# Altium schematic sheet Bank_3.SchDoc: Kasli-DIOT
size 420 x 297 mm; EDA_Number: ARTIQ; Projet: ARTIQ/SINARA; Author: G.Kasprowicz; CompanyName: WUT ISE; DrawnBy: F.Świtakowski; Organization: WUT ISE; Address1: PW ISE; Address2: Nowowiejska 15/19 00-665 Warsaw; Address3: gkasprow@gmail.com; Revision: 1; SheetNumber: -; SheetTotal: -; ModifiedBy: -; CheckedDate: -; Title2: Bank 16 32 36; DivGrp: WUT ISE; Designer: F.Świtakowski; ModifiedDate: -; ProjectName: Sensor Box
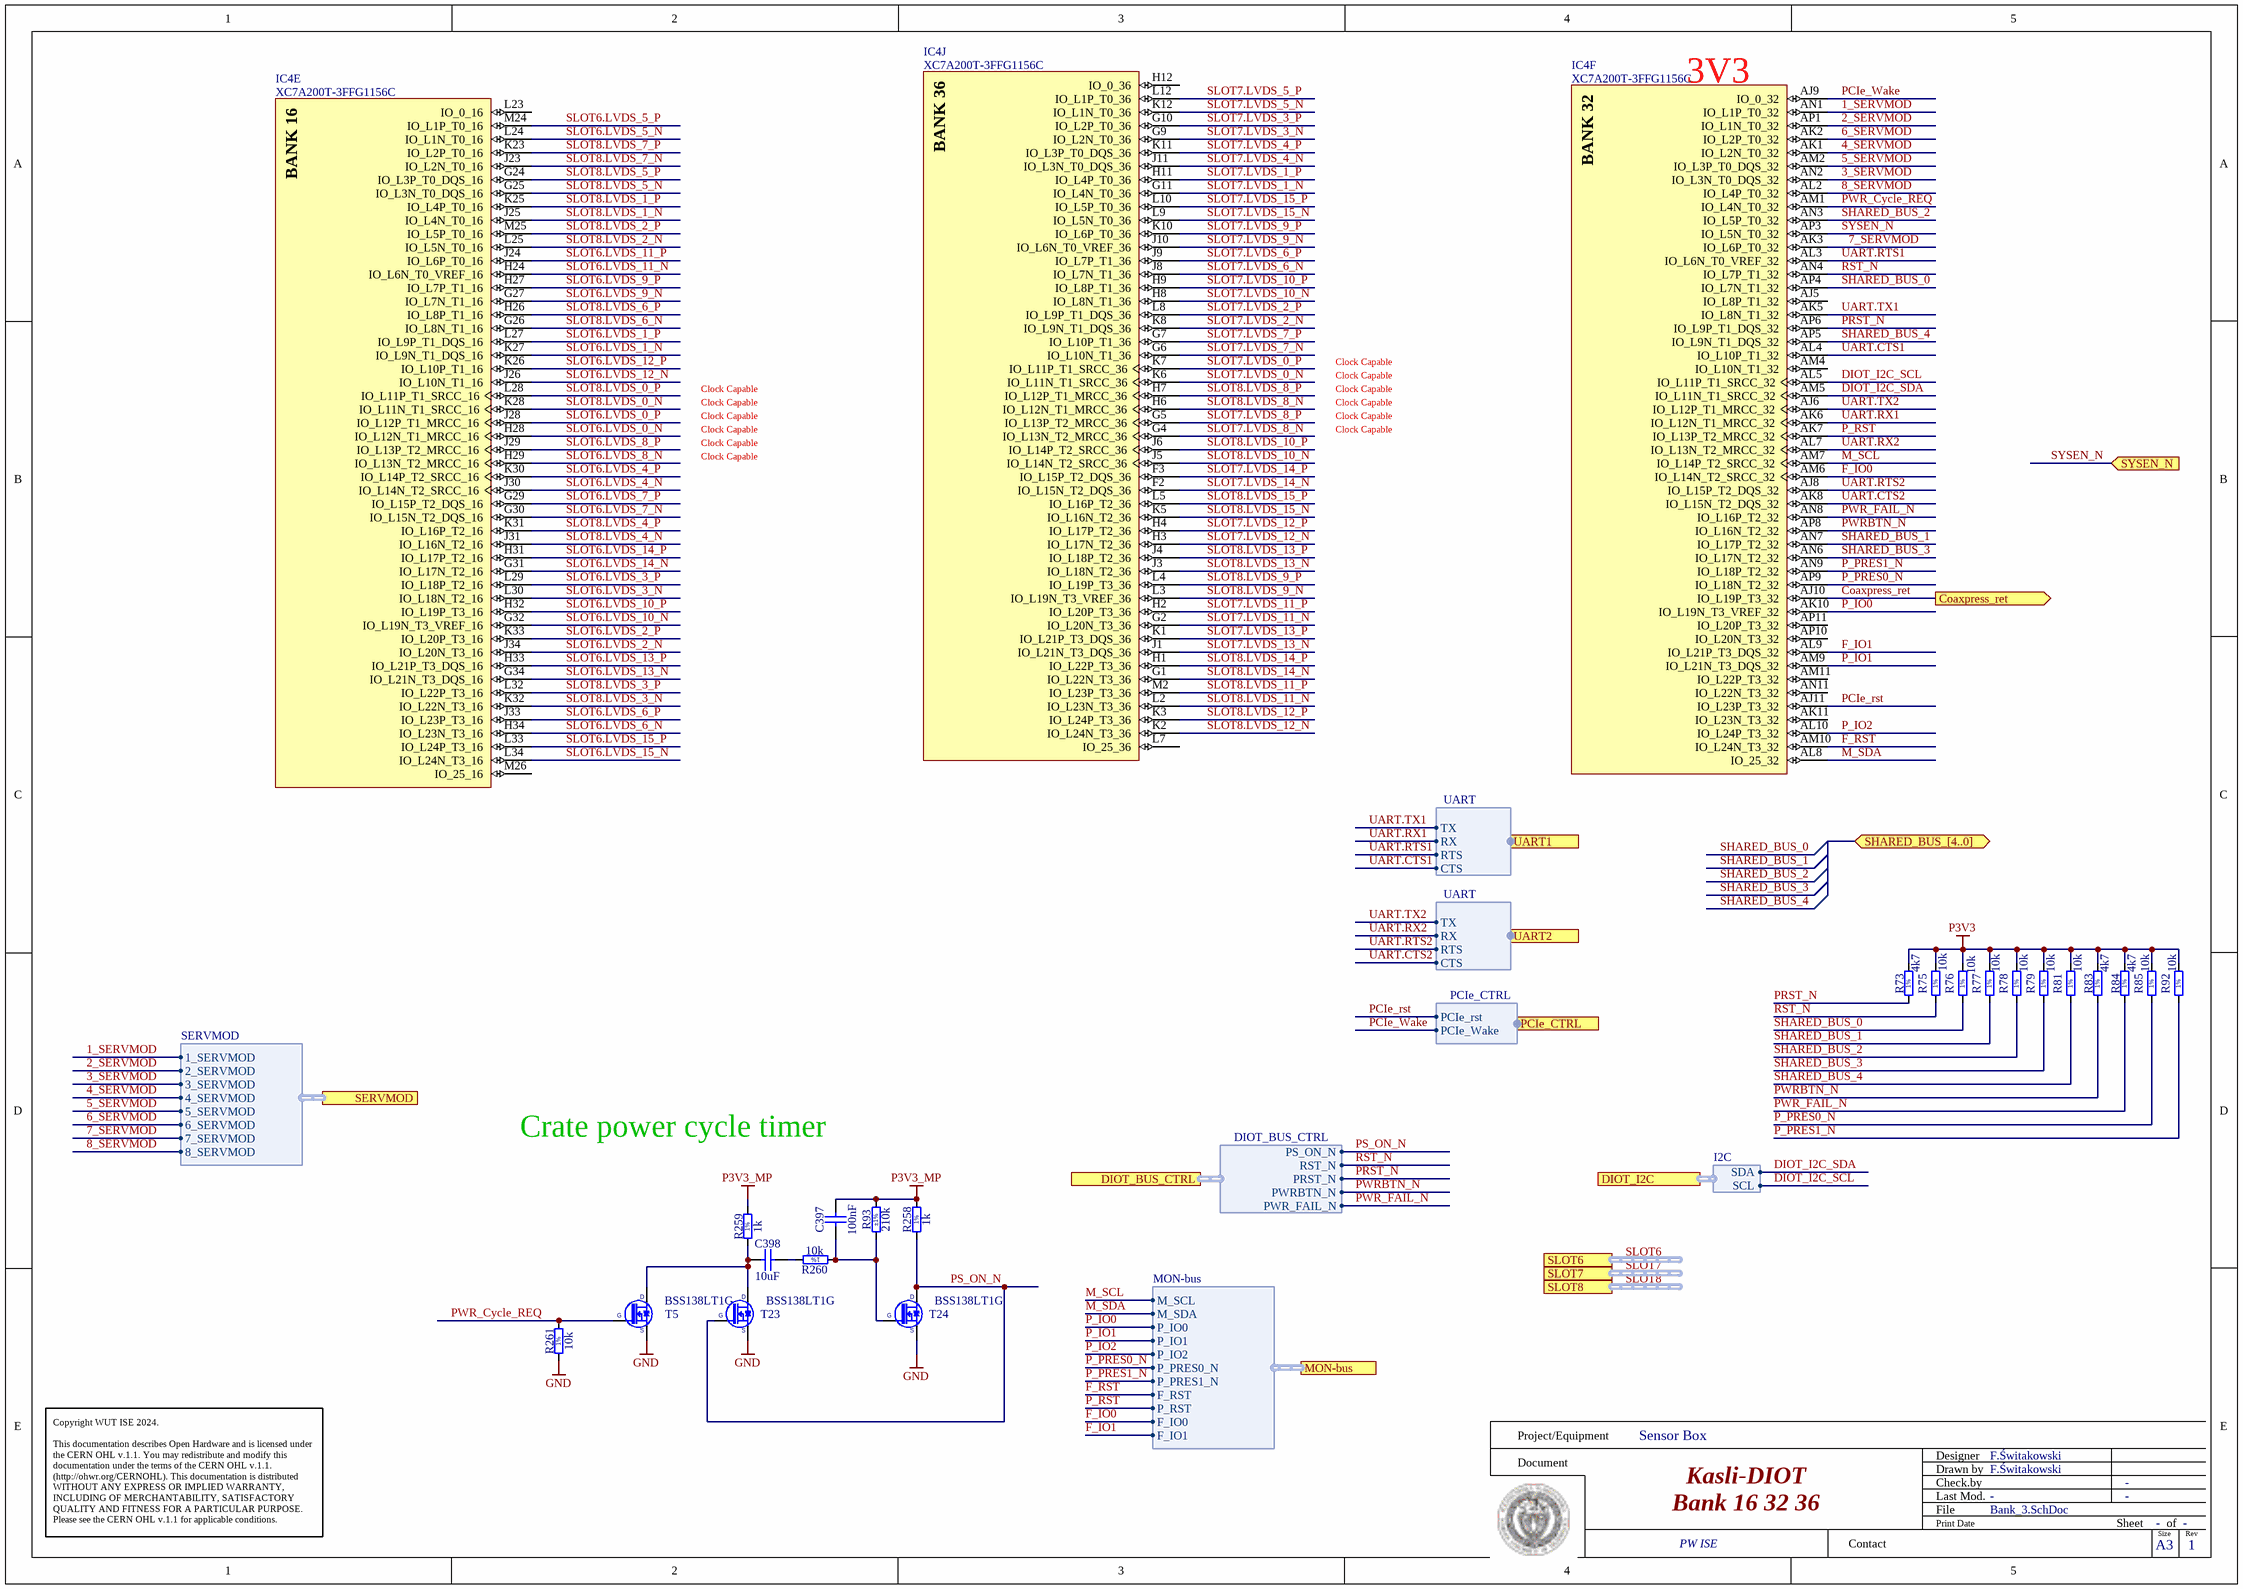
[diagram p0: Bank_3.SchDoc]

## Parts
C397  100nF  [CAPC1005X55N]
C398  10uF  [CAPC3216X180N]
IC4  XC7A200T-3FFG1156C  [BGA1156C100P34X34_3500X3500X310]  (parts E,F,J of 18)
R73  4k7  [RESC1005X40N]
R75  10k  [RESC1005X40N]
R76  10k  [RESC1005X40N]
R77  10k  [RESC1005X40N]
R78  10k  [RESC1005X40N]
R79  10k  [RESC1005X40N]
R81  10k  [RESC1005X40N]
R83  4k7  [RESC1005X40N]
R84  4k7  [RESC1005X40N]
R85  10k  [RESC1005X40N]
R92  10k  [RESC1005X40N]
R93  210k  Tolerance: ±1%  [RESC1005X40N]
R258  1k  [RESC1005X40N]
R259  1k  [RESC1005X40N]
R260  10k  [RESC1005X40N]
R261  10k  [RESC1005X40N]
T5  BSS138LT1G  [SOT95P240X110-3N]
T23  BSS138LT1G  [SOT95P240X110-3N]
T24  BSS138LT1G  [SOT95P240X110-3N]

## Ports
Coaxpress_ret (out), DIOT_BUS_CTRL (harness DIOT_BUS_CTRL), DIOT_I2C (harness I2C), MON-bus (harness MON-bus), PCIe_CTRL (harness PCIe_CTRL), SERVMOD (harness SERVMOD), SHARED_BUS_[4..0] (bidir), SLOT6 (harness SLOT), SLOT7 (harness SLOT), SLOT8 (harness SLOT), SYSEN_N (in), UART1 (harness UART), UART2 (harness UART)

## Harnesses
DIOT_BUS_CTRL: PS_ON_N, RST_N, PRST_N, PWRBTN_N, PWR_FAIL_N
I2C: SDA, SCL
SERVMOD: 5_SERVMOD, 6_SERVMOD, 2_SERVMOD, 7_SERVMOD, 3_SERVMOD, 4_SERVMOD, 1_SERVMOD, 8_SERVMOD
MON-bus: M_SCL, M_SDA, P_IO0, P_IO1, P_IO2, P_PRES0_N, P_PRES1_N, F_RST, P_RST, F_IO0, F_IO1
UART: TX, RX, RTS, CTS
PCIe_CTRL: PCIe_rst, PCIe_Wake

## Nets
GND: R261.1 T5.2(S) T23.2(S) T24.2(S)
P3V3: R73.2 R75.2 R76.2 R77.2 R78.2 R79.2 R81.2 R83.2 R84.2 R85.2 R92.2
P3V3_MP: C397.2 R93.2 R258.2 R259.2
1_SERVMOD: IC4.AN1(IO_L1P_T0_32) ; port SERVMOD.1_SERVMOD
2_SERVMOD: IC4.AP1(IO_L1N_T0_32) ; port SERVMOD.2_SERVMOD
3_SERVMOD: IC4.AN2(IO_L3N_T0_DQS_32) ; port SERVMOD.3_SERVMOD
4_SERVMOD: IC4.AK1(IO_L2N_T0_32) ; port SERVMOD.4_SERVMOD
5_SERVMOD: IC4.AM2(IO_L3P_T0_DQS_32) ; port SERVMOD.5_SERVMOD
6_SERVMOD: IC4.AK2(IO_L2P_T0_32) ; port SERVMOD.6_SERVMOD
7_SERVMOD: IC4.AK3(IO_L6P_T0_32) ; port SERVMOD.7_SERVMOD
8_SERVMOD: IC4.AL2(IO_L4P_T0_32) ; port SERVMOD.8_SERVMOD
Coaxpress_ret: IC4.AJ10(IO_L19P_T3_32) ; port Coaxpress_ret
DIOT_I2C_SCL: IC4.AL5(IO_L11P_T1_SRCC_32) ; port DIOT_I2C.SCL
DIOT_I2C_SDA: IC4.AM5(IO_L11N_T1_SRCC_32) ; port DIOT_I2C.SDA
F_IO0: IC4.AM6(IO_L14N_T2_SRCC_32) ; port MON-bus.F_IO0
F_IO1: IC4.AL9(IO_L21P_T3_DQS_32) ; port MON-bus.F_IO1
F_RST: IC4.AM10(IO_L24N_T3_32) ; port MON-bus.F_RST
M_SCL: IC4.AM7(IO_L14P_T2_SRCC_32) ; port MON-bus.M_SCL
M_SDA: IC4.AL8(IO_25_32) ; port MON-bus.M_SDA
P_IO0: IC4.AK10(IO_L19N_T3_VREF_32) ; port MON-bus.P_IO0
P_IO1: IC4.AM9(IO_L21N_T3_DQS_32) ; port MON-bus.P_IO1
P_IO2: IC4.AL10(IO_L24P_T3_32) ; port MON-bus.P_IO2
P_PRES0_N: IC4.AP9(IO_L18N_T2_32) R85.1 ; port MON-bus.P_PRES0_N
P_PRES1_N: IC4.AN9(IO_L18P_T2_32) R92.1 ; port MON-bus.P_PRES1_N
P_RST: IC4.AK7(IO_L13P_T2_MRCC_32) ; port MON-bus.P_RST
PCIe_rst: IC4.AJ11(IO_L23P_T3_32) ; port PCIe_CTRL.PCIe_rst
PCIe_Wake: IC4.AJ9(IO_0_32) ; port PCIe_CTRL.PCIe_Wake
PRST_N: IC4.AP6(IO_L9P_T1_DQS_32) R73.1 ; port DIOT_BUS_CTRL.PRST_N
PS_ON_N: R258.1 T23.1(G) T24.3(D) ; port DIOT_BUS_CTRL.PS_ON_N
PWR_Cycle_REQ: IC4.AM1(IO_L4N_T0_32) R261.2 T5.1(G)
PWR_FAIL_N: IC4.AN8(IO_L16P_T2_32) R84.1 ; port DIOT_BUS_CTRL.PWR_FAIL_N
PWRBTN_N: IC4.AP8(IO_L16N_T2_32) R83.1 ; port DIOT_BUS_CTRL.PWRBTN_N
RST_N: IC4.AN4(IO_L7P_T1_32) R75.1 ; port DIOT_BUS_CTRL.RST_N
SHARED_BUS_0: IC4.AP4(IO_L7N_T1_32) R76.1
SHARED_BUS_1: IC4.AN7(IO_L17P_T2_32) R77.1
SHARED_BUS_2: IC4.AN3(IO_L5P_T0_32) R78.1
SHARED_BUS_3: IC4.AN6(IO_L17N_T2_32) R79.1
SHARED_BUS_4: IC4.AP5(IO_L9N_T1_DQS_32) R81.1
SLOT6.LVDS_0_N: IC4.H28(IO_L12N_T1_MRCC_16)
SLOT6.LVDS_0_P: IC4.J28(IO_L12P_T1_MRCC_16)
SLOT6.LVDS_1_N: IC4.K27(IO_L9N_T1_DQS_16)
SLOT6.LVDS_1_P: IC4.L27(IO_L9P_T1_DQS_16)
SLOT6.LVDS_2_N: IC4.J34(IO_L20N_T3_16)
SLOT6.LVDS_2_P: IC4.K33(IO_L20P_T3_16)
SLOT6.LVDS_3_N: IC4.L30(IO_L18N_T2_16)
SLOT6.LVDS_3_P: IC4.L29(IO_L18P_T2_16)
SLOT6.LVDS_4_N: IC4.J30(IO_L14N_T2_SRCC_16)
SLOT6.LVDS_4_P: IC4.K30(IO_L14P_T2_SRCC_16)
SLOT6.LVDS_5_N: IC4.L24(IO_L1N_T0_16)
SLOT6.LVDS_5_P: IC4.M24(IO_L1P_T0_16)
SLOT6.LVDS_6_N: IC4.H34(IO_L23N_T3_16)
SLOT6.LVDS_6_P: IC4.J33(IO_L23P_T3_16)
SLOT6.LVDS_7_N: IC4.G30(IO_L15N_T2_DQS_16)
SLOT6.LVDS_7_P: IC4.G29(IO_L15P_T2_DQS_16)
SLOT6.LVDS_8_N: IC4.H29(IO_L13N_T2_MRCC_16)
SLOT6.LVDS_8_P: IC4.J29(IO_L13P_T2_MRCC_16)
SLOT6.LVDS_9_N: IC4.G27(IO_L7N_T1_16)
SLOT6.LVDS_9_P: IC4.H27(IO_L7P_T1_16)
SLOT6.LVDS_10_N: IC4.G32(IO_L19N_T3_VREF_16)
SLOT6.LVDS_10_P: IC4.H32(IO_L19P_T3_16)
SLOT6.LVDS_11_N: IC4.H24(IO_L6N_T0_VREF_16)
SLOT6.LVDS_11_P: IC4.J24(IO_L6P_T0_16)
SLOT6.LVDS_12_N: IC4.J26(IO_L10N_T1_16)
SLOT6.LVDS_12_P: IC4.K26(IO_L10P_T1_16)
SLOT6.LVDS_13_N: IC4.G34(IO_L21N_T3_DQS_16)
SLOT6.LVDS_13_P: IC4.H33(IO_L21P_T3_DQS_16)
SLOT6.LVDS_14_N: IC4.G31(IO_L17N_T2_16)
SLOT6.LVDS_14_P: IC4.H31(IO_L17P_T2_16)
SLOT6.LVDS_15_N: IC4.L34(IO_L24N_T3_16)
SLOT6.LVDS_15_P: IC4.L33(IO_L24P_T3_16)
SLOT7.LVDS_0_N: IC4.K6(IO_L11N_T1_SRCC_36)
SLOT7.LVDS_0_P: IC4.K7(IO_L11P_T1_SRCC_36)
SLOT7.LVDS_1_N: IC4.G11(IO_L4N_T0_36)
SLOT7.LVDS_1_P: IC4.H11(IO_L4P_T0_36)
SLOT7.LVDS_2_N: IC4.K8(IO_L9N_T1_DQS_36)
SLOT7.LVDS_2_P: IC4.L8(IO_L9P_T1_DQS_36)
SLOT7.LVDS_3_N: IC4.G9(IO_L2N_T0_36)
SLOT7.LVDS_3_P: IC4.G10(IO_L2P_T0_36)
SLOT7.LVDS_4_N: IC4.J11(IO_L3N_T0_DQS_36)
SLOT7.LVDS_4_P: IC4.K11(IO_L3P_T0_DQS_36)
SLOT7.LVDS_5_N: IC4.K12(IO_L1N_T0_36)
SLOT7.LVDS_5_P: IC4.L12(IO_L1P_T0_36)
SLOT7.LVDS_6_N: IC4.J8(IO_L7N_T1_36)
SLOT7.LVDS_6_P: IC4.J9(IO_L7P_T1_36)
SLOT7.LVDS_7_N: IC4.G6(IO_L10N_T1_36)
SLOT7.LVDS_7_P: IC4.G7(IO_L10P_T1_36)
SLOT7.LVDS_8_N: IC4.G4(IO_L13N_T2_MRCC_36)
SLOT7.LVDS_8_P: IC4.G5(IO_L13P_T2_MRCC_36)
SLOT7.LVDS_9_N: IC4.J10(IO_L6N_T0_VREF_36)
SLOT7.LVDS_9_P: IC4.K10(IO_L6P_T0_36)
SLOT7.LVDS_10_N: IC4.H8(IO_L8N_T1_36)
SLOT7.LVDS_10_P: IC4.H9(IO_L8P_T1_36)
SLOT7.LVDS_11_N: IC4.G2(IO_L20N_T3_36)
SLOT7.LVDS_11_P: IC4.H2(IO_L20P_T3_36)
SLOT7.LVDS_12_N: IC4.H3(IO_L17N_T2_36)
SLOT7.LVDS_12_P: IC4.H4(IO_L17P_T2_36)
SLOT7.LVDS_13_N: IC4.J1(IO_L21N_T3_DQS_36)
SLOT7.LVDS_13_P: IC4.K1(IO_L21P_T3_DQS_36)
SLOT7.LVDS_14_N: IC4.F2(IO_L15N_T2_DQS_36)
SLOT7.LVDS_14_P: IC4.F3(IO_L15P_T2_DQS_36)
SLOT7.LVDS_15_N: IC4.L9(IO_L5N_T0_36)
SLOT7.LVDS_15_P: IC4.L10(IO_L5P_T0_36)
SLOT8.LVDS_0_N: IC4.K28(IO_L11N_T1_SRCC_16)
SLOT8.LVDS_0_P: IC4.L28(IO_L11P_T1_SRCC_16)
SLOT8.LVDS_1_N: IC4.J25(IO_L4N_T0_16)
SLOT8.LVDS_1_P: IC4.K25(IO_L4P_T0_16)
SLOT8.LVDS_2_N: IC4.L25(IO_L5N_T0_16)
SLOT8.LVDS_2_P: IC4.M25(IO_L5P_T0_16)
SLOT8.LVDS_3_N: IC4.K32(IO_L22N_T3_16)
SLOT8.LVDS_3_P: IC4.L32(IO_L22P_T3_16)
SLOT8.LVDS_4_N: IC4.J31(IO_L16N_T2_16)
SLOT8.LVDS_4_P: IC4.K31(IO_L16P_T2_16)
SLOT8.LVDS_5_N: IC4.G25(IO_L3N_T0_DQS_16)
SLOT8.LVDS_5_P: IC4.G24(IO_L3P_T0_DQS_16)
SLOT8.LVDS_6_N: IC4.G26(IO_L8N_T1_16)
SLOT8.LVDS_6_P: IC4.H26(IO_L8P_T1_16)
SLOT8.LVDS_7_N: IC4.J23(IO_L2N_T0_16)
SLOT8.LVDS_7_P: IC4.K23(IO_L2P_T0_16)
SLOT8.LVDS_8_N: IC4.H6(IO_L12N_T1_MRCC_36)
SLOT8.LVDS_8_P: IC4.H7(IO_L12P_T1_MRCC_36)
SLOT8.LVDS_9_N: IC4.L3(IO_L19N_T3_VREF_36)
SLOT8.LVDS_9_P: IC4.L4(IO_L19P_T3_36)
SLOT8.LVDS_10_N: IC4.J5(IO_L14N_T2_SRCC_36)
SLOT8.LVDS_10_P: IC4.J6(IO_L14P_T2_SRCC_36)
SLOT8.LVDS_11_N: IC4.L2(IO_L23N_T3_36)
SLOT8.LVDS_11_P: IC4.M2(IO_L23P_T3_36)
SLOT8.LVDS_12_N: IC4.K2(IO_L24N_T3_36)
SLOT8.LVDS_12_P: IC4.K3(IO_L24P_T3_36)
SLOT8.LVDS_13_N: IC4.J3(IO_L18N_T2_36)
SLOT8.LVDS_13_P: IC4.J4(IO_L18P_T2_36)
SLOT8.LVDS_14_N: IC4.G1(IO_L22N_T3_36)
SLOT8.LVDS_14_P: IC4.H1(IO_L22P_T3_36)
SLOT8.LVDS_15_N: IC4.K5(IO_L16N_T2_36)
SLOT8.LVDS_15_P: IC4.L5(IO_L16P_T2_36)
SYSEN_N: IC4.AP3(IO_L5N_T0_32) ; port SYSEN_N
UART.CTS1: IC4.AL4(IO_L10P_T1_32) ; port UART1.CTS
UART.CTS2: IC4.AK8(IO_L15N_T2_DQS_32) ; port UART2.CTS
UART.RTS1: IC4.AL3(IO_L6N_T0_VREF_32) ; port UART1.RTS
UART.RTS2: IC4.AJ8(IO_L15P_T2_DQS_32) ; port UART2.RTS
UART.RX1: IC4.AK6(IO_L12N_T1_MRCC_32) ; port UART1.RX
UART.RX2: IC4.AL7(IO_L13N_T2_MRCC_32) ; port UART2.RX
UART.TX1: IC4.AK5(IO_L8N_T1_32) ; port UART1.TX
UART.TX2: IC4.AJ6(IO_L12P_T1_MRCC_32) ; port UART2.TX
NetC397_1: C397.1 R93.1 R260.1 T24.1(G)
NetC398_1: C398.1 R259.1 T5.3(D) T23.3(D)
NetC398_2: C398.2 R260.2

Not connected (* = marked no-connect by the designer): IC4 AJ5(IO_L8P_T1_32) AK11(IO_L23N_T3_32) AM4(IO_L10N_T1_32) AM11(IO_L22P_T3_32) AN11(IO_L22N_T3_32) AP10(IO_L20N_T3_32) AP11(IO_L20P_T3_32) H12(IO_0_36) L7(IO_25_36) L23(IO_0_16) M26(IO_25_16)

## Buses and harness runs
harness SLOT6 = port SLOT6
harness SLOT7 = port SLOT7
harness SLOT8 = port SLOT8

## Notes on the sheet
- (near IC4) 3V3
- Clock Capable
- Crate power cycle timer
- Project/Equipment
- Document
- Designer
- Drawn by
- Check.by
- Copyright WUT ISE 2024.
  This documentation describes Open Hardware and is licensed under the CERN OHL v.1.1. You may redistribute and modify this documentation under the terms of the CERN OHL v.1.1. (http://ohwr.org/CERNOHL). This documentation is distributed WITHOUT ANY EXPRESS OR IMPLIED WARRANTY, INCLUDING OF MERCHANTABILITY, SATISFACTORY QUALITY AND FITNESS FOR A PARTICULAR PURPOSE. Please see the CERN OHL v.1.1 for applicable conditions.
- Contact
- File
- Last Mod.
- Print Date
- Sheet
- Size
- A3
- of
- Rev
- (in symbol R0402_1K_1%_0.0625W_100PPM) 1%
- (in symbol R0402_4K7_1%_0.0625W_100PPM) 1%
- (in symbol R0402_10K_1%_0.0625W_100PPM) 1%
- (in symbol XC7A200T-3FFG1156C, part E) BANK 16
- (in symbol XC7A200T-3FFG1156C, part F) BANK 32
- (in symbol XC7A200T-3FFG1156C, part J) BANK 36

## Library data of the parts
C397 = CC0402_100NF_16V_10%_X7R: Non-polarised capacitor; Part Description: SMD Multilayer Chip Ceramic Capacitor; Manufacturer: GENERIC; Manufacturer1 Part Number: GRM155R71C104KA88D; Voltage: 16V; TC: X7R; Tolerance: ±10%; Part Number: CC0402_100NF_16V_10%_X7R; Component Kind: Standard; Component Type: Standard; Pin Count: 2; Value: 100nF; Status: Not Recommended; Manufacturer Part Number: CC0402_100NF_16V_10%_X7R; Case: 0402; Mounted: Yes; Socket: No; SMD: Yes; Sense: No; Manufacturer1 Example: MURATA; Manufacturer1 ComponentHeight: 0.55mm; HelpURL: \\cern.ch\dfs\Applications\Altium\Datasheets\CC0402_X7R_MURATA_GRM.pdf; Author: CERN DEM JLC; CreateDate: 05/12/2013; LatestRevisionDate: 03/12/2007
C398 = CC1206_10UF_25V_10%_X7R: Non-polarised capacitor; Part Description: SMD Multilayer Chip Ceramic Capacitor; Manufacturer: GENERIC; Manufacturer1 Part Number: C1206C106K4RACTU; Voltage: 25V; TC: X7R; Tolerance: ±10%; Part Number: CC1206_10UF_25V_10%_X7R; Component Kind: Standard; Component Type: Standard; Pin Count: 2; Value: 10uF; Status: Preferred; Manufacturer Part Number: CC1206_10UF_25V_10%_X7R; Case: 1206; Mounted: Yes; Socket: No; SMD: Yes; Sense: No; Manufacturer1 Example: KEMET; Manufacturer1 ComponentHeight: 1.8mm; HelpURL: \\cern.ch\dfs\Applications\Altium\Datasheets\CC1206_X7R_KEMET.pdf; Author: CERN DEM JLC; CreateDate: 12/09/2012; LatestRevisionDate: 12/09/2012
IC4 = XC7A200T-3FFG1156C: Artix-7 FPGA, 500 User I/Os, 16 GTP, 1156-Ball BGA, , Speed Grade 3, Commercial Grade, Pb-Free; Part Description: Artix-7 FPGA, 500 User I/Os, 16 GTP, 1156-Ball BGA, Speed Grade 3, Commercial Grade, Pb-Free; Manufacturer: XILINX; PressFit: No; Bonding: No; Part Number: XC7A200T-3FFG1156C; Component Kind: Standard; Component Type: Standard; Device: XC7A200T-3FFG1156C; PackageDescription: BGA, 1.00mm Pitch, Square; 1156 Pin, 34 Columns X 34 Rows, Body 35.00mm X 35.0mm X 3.10mm H, IPC Medium Density; Manufacturer Part Number: XC7A200T-3FFG1156C; Pin Count: 1156; Case: BGA1156; Mounted: Yes; Socket: No; SMD: Yes; Sense: No; ComponentHeight: 3.1mm; HelpURL: \\cern.ch\dfs\Applications\Altium\Datasheets\XC7A200T-3FFG1156C.pdf; ComponentLink1URL: \\cern.ch\dfs\Applications\Altium\Datasheets\XC7A200T-3FFG1156C_Package.pdf; ComponentLink1Description: Package; ComponentLink2URL: \\cern.ch\dfs\Applications\Altium\Datasheets\XC7A200T-3FFG1156C_Pinout.txt; ComponentLink2Description: Pinout; Author: CERN DEM JLC; CreateDate: 07.11.2016; LatestRevisionDate: 07.11.2016
R73 R83 R84 = R0402_4K7_1%_0.0625W_100PPM: Resistor - 1%; Part Description: General Purpose Thick Film Chip Resistor; Manufacturer: GENERIC; Manufacturer1 Part Number: 232270674702L; TC: ±100ppm/°C; PressFit: No; Part Number: R0402_4K7_1%_0.0625W_100PPM; Component Kind: Standard; Component Type: Standard; Pin Count: 2; Value: 4k7; Status: Not Recommended; Power: 0.0625W; Tolerance: ±1%; Manufacturer Part Number: R0402_4K7_1%_0.0625W_100PPM; Case: 0402; Mounted: Yes; Sense: No; Socket: No; SMD: Yes; Manufacturer1 Example: YAGEO PHYCOMP; Manufacturer1 ComponentHeight: 0.4mm; HelpURL: \\cern.ch\dfs\Applications\Altium\Datasheets\R0402_Phycomp_RC0402.pdf; Author: CERN DEM JLC; CreateDate: 03-Dec-07; LatestRevisionDate: 17-Oct-12
R75-R79 R81 R85 R92 R260 R261 = R0402_10K_1%_0.0625W_100PPM: Resistor - 1%; Part Description: General Purpose Thick Film Chip Resistor; Manufacturer: GENERIC; Manufacturer1 Part Number: 232270671003L; TC: ±100ppm/°C; PressFit: No; Part Number: R0402_10K_1%_0.0625W_100PPM; Component Kind: Standard; Component Type: Standard; Pin Count: 2; Value: 10k; Status: Not Recommended; Power: 0.0625W; Tolerance: ±1%; Manufacturer Part Number: R0402_10K_1%_0.0625W_100PPM; Case: 0402; Mounted: Yes; Sense: No; Socket: No; SMD: Yes; Manufacturer1 Example: YAGEO PHYCOMP; Manufacturer1 ComponentHeight: 0.4mm; HelpURL: \\cern.ch\dfs\Applications\Altium\Datasheets\R0402_Phycomp_RC0402.pdf; Author: CERN DEM JLC
  R75-R79 R81 R85 R92: CreateDate: 03.12.2007; LatestRevisionDate: 17.10.2012
  R260 R261: CreateDate: 03/12/2007; LatestRevisionDate: 17/10/2012
R93 = R0402_210K_1%_0.063W_100PPM: Resistor - 1%; Part Description: General Purpose Thick Film Chip Resistor; Manufacturer: GENERIC; Manufacturer1 Part Number: CRCW0402210KFK; Power: 0.063W; TC: ±100ppm/°C; PressFit: No; Part Number: R0402_210K_1%_0.063W_100PPM; Component Kind: Standard; Component Type: Standard; Pin Count: 2; Value: 210k; Status: None; Manufacturer Part Number: R0402_210K_1%_0.063W_100PPM; Case: 0402; Mounted: Yes; Sense: No; Socket: No; SMD: Yes; Manufacturer1 Example: VISHAY; Manufacturer1 ComponentHeight: 0.4mm; HelpURL: \\cern.ch\dfs\Applications\Altium\Datasheets\R0402_VISHAY_CRCW e3.pdf; Author: CERN DEM BC; CreateDate: 08/02/2021; LatestRevisionDate: 08/02/2021
R258 R259 = R0402_1K_1%_0.0625W_100PPM: Resistor - 1%; Part Description: General Purpose Thick Film Chip Resistor; Manufacturer: GENERIC; Manufacturer1 Part Number: 232270671002L; TC: ±100ppm/°C; PressFit: No; Part Number: R0402_1K_1%_0.0625W_100PPM; Component Kind: Standard; Component Type: Standard; Pin Count: 2; Value: 1k; Status: Not Recommended; Power: 0.0625W; Tolerance: ±1%; Manufacturer Part Number: R0402_1K_1%_0.0625W_100PPM; Case: 0402; Mounted: Yes; Sense: No; Socket: No; SMD: Yes; Manufacturer1 Example: YAGEO PHYCOMP; Manufacturer1 ComponentHeight: 0.4mm; HelpURL: \\cern.ch\dfs\Applications\Altium\Datasheets\R0402_Phycomp_RC0402.pdf; Author: CERN DEM JLC; CreateDate: 03/12/2007; LatestRevisionDate: 17/10/2012
T5 T23 T24 = BSS138LT1G: N-CHANNEL MOSFET WITH DIODE; Part Description: 50V, 200mA N-Channel Enhancement Mode Field-Effect Transistor; Manufacturer: ON SEMICONDUCTOR; PressFit: No; Bonding: No; Part Number: BSS138LT1G; Component Kind: Standard; Component Type: Standard; Device: BSS138LT1G; PackageDescription: SOT23, 0.95mm Pitch; 3 Pin, 1.40mm W X 3.00mm L X 1.10mm H body, IPC Medium Density; Manufacturer Part Number: BSS138L; Pin Count: 3; Case: SOT23-3; Mounted: Yes; Socket: No; SMD: Yes; Sense: No; ComponentHeight: 1.11mm; HelpURL: \\cern.ch\dfs\Applications\Altium\Datasheets\BSS138LT1G.pdf; Author: CERN DEM JLC; CreateDate: 23/03/2009; LatestRevisionDate: 25/05/2022